# Altium project Seti-Controler-3C.PrjPcb
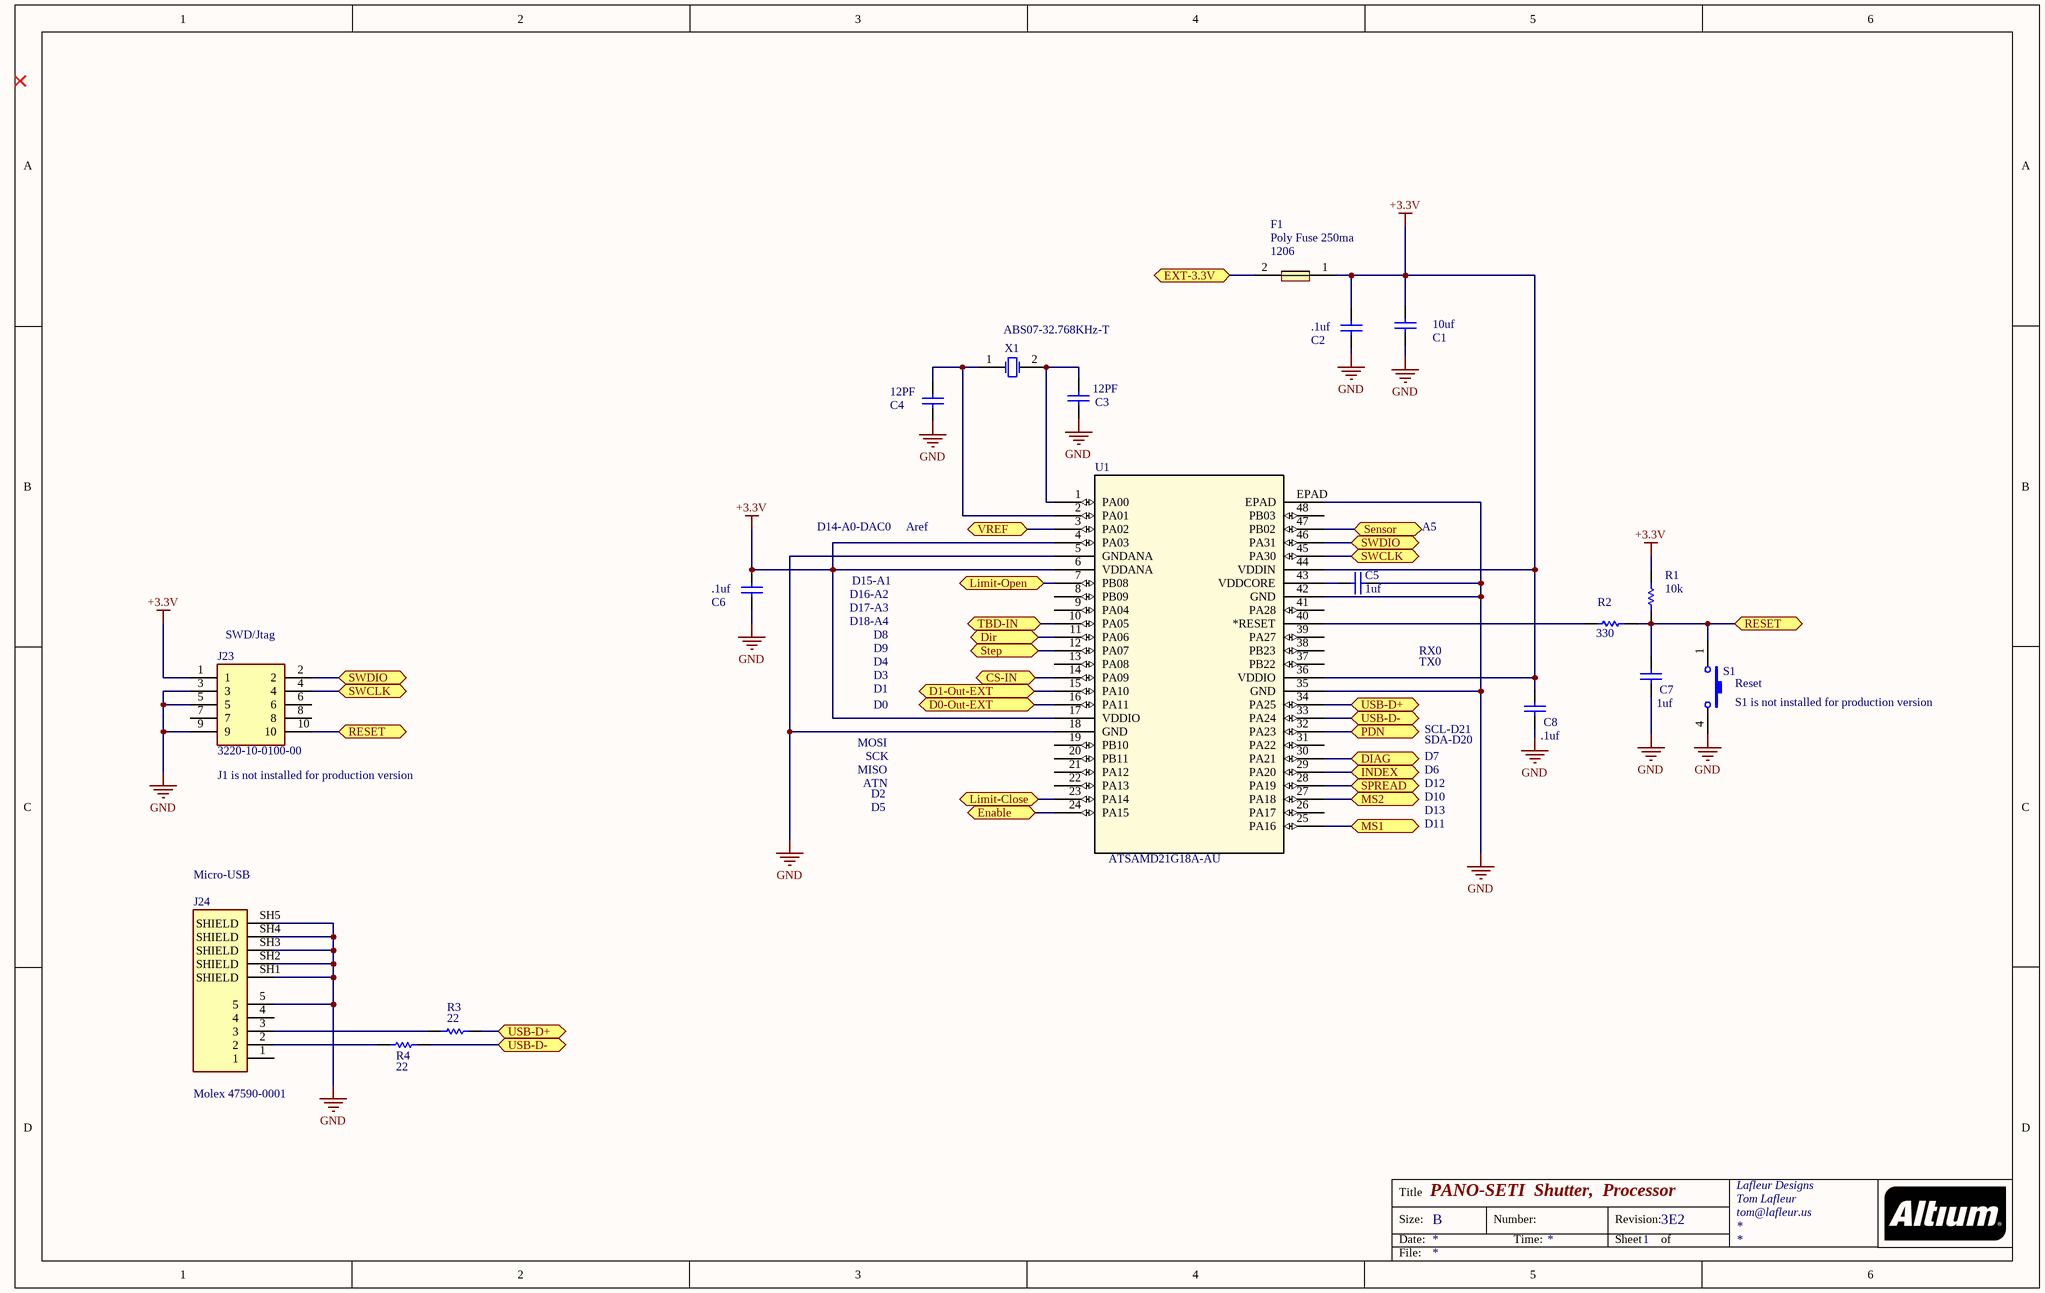
[diagram p0: Sheet1.SchDoc]
2 sheets, 55 parts. Net scope: flat (ports and power ports of the same name join across sheets).
Board file: PCB1.PcbDoc
Sheets:
  Sheet1.SchDoc
  Sheet2.SchDoc

## Sheet Sheet1.SchDoc: PANO-SETI  Shutter,  Processor
size B; Organization: Lafleur Designs; Address1: Tom Lafleur; Address2: tom@lafleur.us; Revision: 3E2; SheetNumber: 1

### Parts
C1  10uf  [6-0805]
C2  .1uf  [6-0805]
C3  12PF  [6-0805]
C4  12PF  [6-0805]
C5  1uf  [6-0805]
C6  .1uf  [6-0805]
C7  1uf  [6-0805]
C8  .1uf  [6-0805]
F1  Poly Fuse 250ma  [8-1206]
J23  3220-10-0100-00  [SHDR10W41P127_2X5_1265X510X565P]
J24  Molex 47590-0001  [Molex 47590-0001]
R1  10k  [6-0805]
R2  330  [6-0805]
R3  22  [6-0805]
R4  22  [6-0805]
S1  Reset  [KMR_2]
U1  ATSAMD21G18A-AU  [TQFP48_7x7MC]
X1  ABS07-32.768KHz-T  [ABRA-ABS07-2_V]

### Ports
CS-IN (bidir), D0-Out-EXT (bidir), D1-Out-EXT (bidir), DIAG (bidir), Dir (bidir), Enable (bidir), EXT-3.3V (bidir), INDEX (bidir), Limit-Close (bidir), Limit-Open (bidir), MS1 (bidir), MS2 (bidir), PDN (bidir), RESET (bidir), Sensor (bidir), SPREAD (bidir), Step (bidir), SWCLK (bidir), SWDIO (bidir), TBD-IN (bidir), USB-D+ (bidir), USB-D- (bidir), VREF (bidir)

### Nets
+3.3V: C1.1 C2.1 C6.1 C8.1 F1.1 J23.1 R1.1 U1.4(PA03) U1.6(VDDANA) U1.17(VDDIO) U1.36(VDDIO) U1.44(VDDIN)
GND: C1.2 C2.2 C3.2 C4.2 C5.2 C6.2 C7.2 C8.2 J23.3 J23.5 J23.9 J24.5 J24.SH1(SHIELD) J24.SH2(SHIELD) J24.SH3(SHIELD) J24.SH4(SHIELD) J24.SH5(SHIELD) S1.4 U1.5(GNDANA) U1.18(GND) U1.35(GND) U1.42(GND) U1.EPAD
NetC3_1: C3.1 U1.1(PA00) X1.2(X2)
NetC4_1: C4.1 U1.2(PA01) X1.1(X1)
NetC5_1: C5.1 U1.43(VDDCORE)
NetC7_1: C7.1 J23.10 R1.2 R2.2 S1.1 ; port RESET
NetC22_2: U1.47(PB02) ; port Sensor
NetF1_2: F1.2 ; port EXT-3.3V
NetJ23_2: J23.2 U1.46(PA31) ; port SWDIO
NetJ23_4: J23.4 U1.45(PA30) ; port SWCLK
NetJ24_2: J24.2 R4.1
NetJ24_3: J24.3 R3.1
NetJP1_2: U1.3(PA02) ; port VREF
NetR2_1: R2.1 U1.40(*RESET)
NetR3_2: R3.2 U1.34(PA25) ; port USB-D+
NetR4_2: R4.2 U1.33(PA24) ; port USB-D-
NetR5_2: U1.24(PA15) ; port Enable
NetR7_1: U1.32(PA23) ; port PDN
NetU1_7: U1.7(PB08) ; port Limit-Open
NetU1_10: U1.10(PA05) ; port TBD-IN
NetU1_11: U1.11(PA06) ; port Dir
NetU1_12: U1.12(PA07) ; port Step
NetU1_14: U1.14(PA09) ; port CS-IN
NetU1_15: U1.15(PA10) ; port D1-Out-EXT
NetU1_16: U1.16(PA11) ; port D0-Out-EXT
NetU1_23: U1.23(PA14) ; port Limit-Close
NetU1_25: U1.25(PA16) ; port MS1
NetU1_27: U1.27(PA18) ; port MS2
NetU1_28: U1.28(PA19) ; port SPREAD
NetU1_29: U1.29(PA20) ; port INDEX
NetU1_30: U1.30(PA21) ; port DIAG

Not connected (* = marked no-connect by the designer): J23 6 7 8; J24 1 4; U1 8(PB09) 9(PA04) 13(PA08) 19(PB10) 20(PB11) 21(PA12) 22(PA13) 26(PA17) 31(PA22) 37(PB22) 38(PB23) 39(PA27) 41(PA28) 48(PB03)

### Notes on the sheet
- (near F1) 1206
- D14-A0-DAC0
- Aref
- A5
- (near J23) SWD/Jtag
- D16-A2
- D17-A3
- D18-A4
- D15-A1
- D8
- D9
- D0
- D1
- D3
- D4
- RX0
- TX0
- (near S1) S1 is not installed for production version
- MOSI
- MISO
- SCK
- D6
- D7
- SCL-D21
- SDA-D20
- (near J23) J1 is not installed for production version
- ATN
- D5
- D2
- D11
- D13
- D10
- D12
- (near J24) Micro-USB
- Title
- Size:
- Date:
- B
- Number:
- Time:
- Revision:
- Sheet
- of
- File:

### Library data of the parts
C1-C8 = CAP_2: Capacitor; Fitted: True
F1 = Poly Fuse
J23 = 3220-10-0100-00: Connector; Manufacturer_Name: CNC Tech; Datasheet Link: http://www.cnctech.us/pdfs/3220-XX-0100-00.pdf; Height: 5.65mm; Manufacturer_Part_Number: 3220-10-0100-00
J24 = 47590-0001: USB - micro AB Receptacle Connector 5 Position Surface Mount, Right Angle; Through Hole; SnapEDA_Link: https://www.snapeda.com/parts/47590-0001/Molex/view-part/47491/?ref=snap; Value: *; MF: Molex; Price: None; Availability: Unavailable; MP: 47590-0001; Package: None
R1-R4 = ERJ8EN: Precision Thick Film Chip Resistor, 10 Ohm to 2.2M Ohm Range, 1% Tolerance, 1206 Size, 0.125 W; Published: 17-Dec-2003; LatestRevisionDate: 19-Mar-2004; LatestRevisionNote: Silkscreen size reduced.; PackageDocument: Mar-2003; PackageReference: 8-1206; Publisher: Altium Limited; Code_IPC: 3216 [1206]; ComponentLink1Description: Manufacturer Link; ComponentLink1URL: http://www.panasonic.com/industrial/components/resistive_products.htm; ComponentLink2Description: Datasheet; ComponentLink2URL: http://www.panasonic.com/industrial/components/pdf/AOA0000CE2.pdf
S1 = SW-PB: Switch; Published: 24-Mar-1999; LatestRevisionDate: 17-Jul-2002; LatestRevisionNote: Re-released for DXP Platform.; PackageReference: SPST-2; Publisher: Altium Limited
U1 = ATSAMD21G18A-AU: No Description Available; Vendor: Microchip; Built_By: EMA_Molly; Manufacturer_Part_Number: ATSAMD21G18A-AU; Copyright: Copyright (C) 2018 Accelerated Designs. All rights reserved; RefDes: RefDes; Type: DEV; Value: Value
X1 = CMP-0447-00001-2: Crystal, 32.768 kHz, 12.5 pF, -40 to 85 degC, SMD Low Profile 3.2 x 1.5 x 0.9 mm, Tape and Reel; Manufacturer: Abracon; Q Value (Type): 30000; Operation Mode: Flexural Mode (Tuning Fork); Shunt Capacitance (C0): 0.9 to 1.2 pF; Load Capacitance (CL): 12.5 pF; Frequency Tolerance @+25degC: +/- 20 ppm; Drive Level (Type): 0.1 uW; Equivalent Series Resistance (R1): 70 Kohm; Insulation Resistance (Min): 500 Mohm; ComponentLink3URL: http://www.abracon.com/Resonators/ABS07.pdf; PackageDescription: 2-Pin Hand Drawn, Body 3.2x1.5mm, Pitch 2.5mm; Operating Temperature: -40 to 85 degC; ComponentLink2URL: http://www.abracon.com/Resonators/ABS07.pdf; PackageReference: ABS07-2; ComponentLink3Description: Package Specification; ComponentLink1Description: Manufacturer URL; DatasheetVersion: 04.03.13; Mounting Technology: Surface Mount; ComponentLink2Description: Datasheet; ComponentLink1URL: http://www.abracon.com/; PartNumber: ABS07-32.768KHz-T; Packing: Tape and Reel; Frequency: 32.768 kHz

## Sheet Sheet2.SchDoc: PANO-SETI  Shutter, Stepper Driver
size B; Organization: Lafleur Designs; Address1: Tom Lafleur; Address2: tom@lafleur.us; Revision: 3E2; SheetNumber: 2
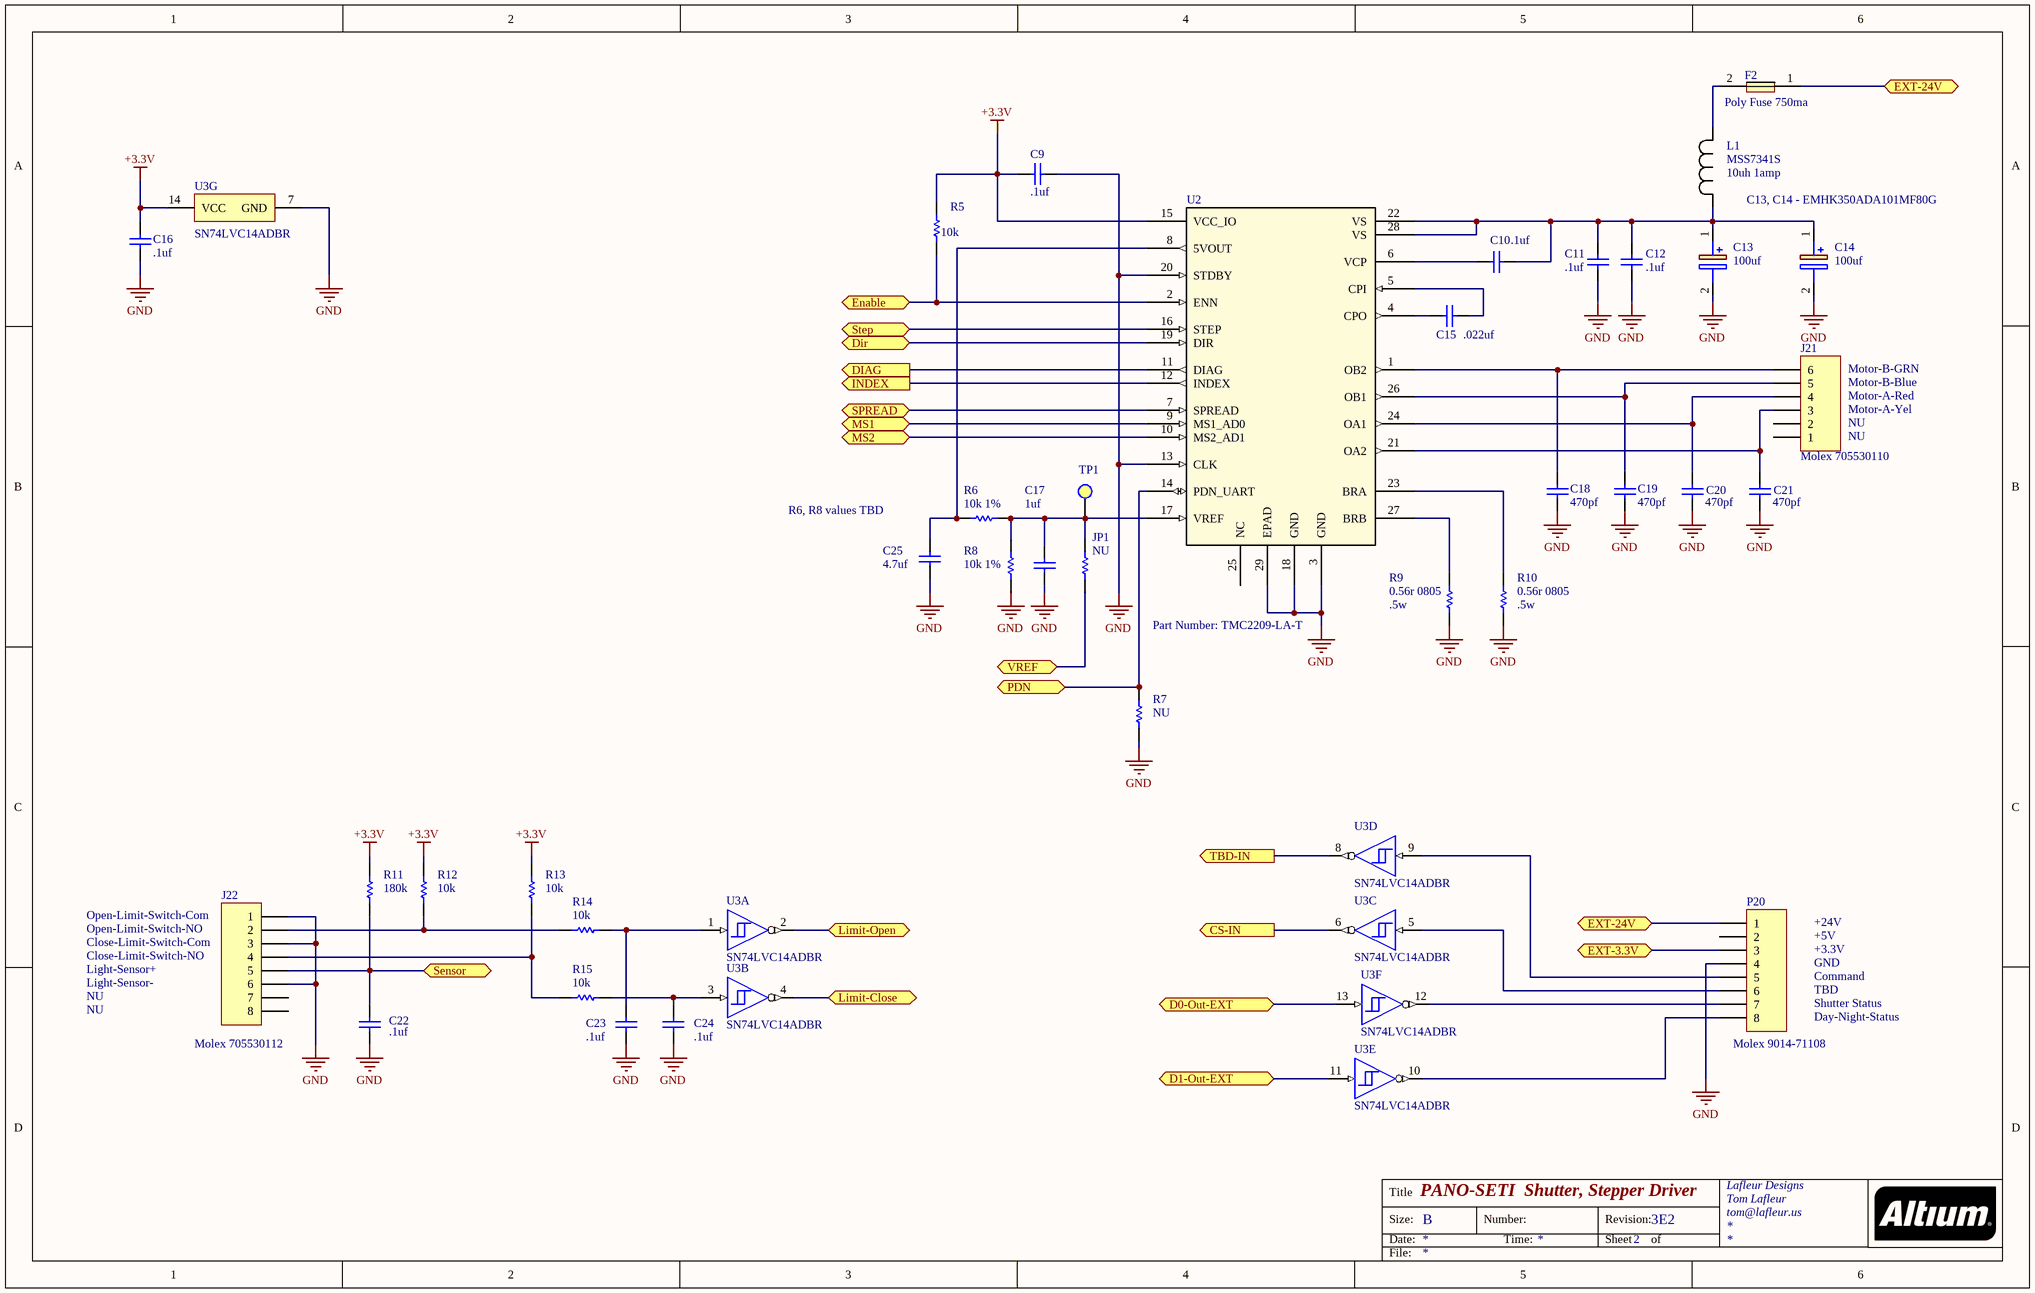
[diagram p1: Sheet2.SchDoc]

### Parts
C9  .1uf  [6-0805]
C10  .1uf  [6-0805]
C11  .1uf  [6-0805]
C12  .1uf  [6-0805]
C13  100uf  [SMD_Lytic_F]
C14  100uf  [SMD_Lytic_F]
C15  .022uf  [6-0805]
C16  .1uf  [6-0805]
C17  1uf  [6-0805]
C18  470pf  [6-0805]
C19  470pf  [6-0805]
C20  470pf  [6-0805]
C21  470pf  [6-0805]
C22  .1uf  [6-0805]
C23  .1uf  [6-0805]
C24  .1uf  [6-0805]
C25  4.7uf  [6-0805]
F2  Poly Fuse 750ma  [PTC 2016L]
J21  Molex 705530110  [HDR1X6]
J22  Molex 705530112  [HDR1X8]
JP1  NU  [6-0805]
L1  MSS7341S  [MSS7341502NLD]
P20  Molex 9014-71108  [HDR1X8]
R5  10k  [6-0805]
R6  10k 1%  [6-0805]
R7  NU  [6-0805]
R8  10k 1%  [6-0805]
R9  0.56r 0805  [6-0805]
R10  0.56r 0805  [6-0805]
R11  180k  [6-0805]
R12  10k  [6-0805]
R13  10k  [6-0805]
R14  10k  [6-0805]
R15  10k  [6-0805]
TP1  TestPoint  [Test Point-Thru-Hole]  (value not drawn)
U2  Part Number: TMC2209-LA-T  [QFN50P500X500X90-29N]
U3  SN74LVC14ADBR  [DB0014A_M]  (parts A,B,C,D,E,F,G of 7)

### Ports
CS-IN (out), D0-Out-EXT (bidir), D1-Out-EXT (bidir), DIAG (out), Dir (bidir), Enable (bidir), EXT-3.3V (bidir), EXT-24V (bidir), INDEX (out), Limit-Close (bidir), Limit-Open (bidir), MS1 (bidir), MS2 (bidir), PDN (bidir), Sensor (bidir), SPREAD (bidir), Step (bidir), TBD-IN (out), VREF (bidir)

### Nets
+3.3V: C9.1 C16.2 R5.1 R11.1 R12.1 R13.1 U2.15(VCC_IO) U3.14(VCC)
GND: C9.2 C11.2 C12.2 C13.2(-) C14.2(-) C16.1 C17.2 C18.2 C19.2 C20.2 C21.2 C22.1 C23.1 C24.1 C25.2 J22.1 J22.3 J22.6 P20.4 R7.2 R8.2 R9.2 R10.2 U2.3(GND) U2.13(CLK) U2.18(GND) U2.20(STDBY) U2.29(EPAD) U3.7(GND)
NetC10_1: C10.1 U2.6(VCP)
NetC10_2: C10.2 C11.1 C12.1 C13.1(+) C14.1(+) L1.2 U2.22(VS) U2.28(VS)
NetC15_1: C15.1 U2.4(CPO)
NetC15_2: C15.2 U2.5(CPI)
NetC17_1: C17.1 JP1.1 R6.2 R8.1 TP1.1(TP?) U2.17(VREF)
NetC18_1: C18.1 J21.6 U2.1(OB2)
NetC19_1: C19.1 J21.5 U2.26(OB1)
NetC20_1: C20.1 J21.4 U2.24(OA1)
NetC21_1: C21.1 J21.3 U2.21(OA2)
NetC22_2: C22.2 J22.5 R11.2 ; port Sensor
NetC23_2: C23.2 R14.2 U3.1(1A)
NetC24_2: C24.2 R15.2 U3.3(2A)
NetC25_1: C25.1 R6.1 U2.8(5VOUT)
NetF1_2: P20.3 ; port EXT-3.3V
NetF2_1: F2.1 P20.1 ; port EXT-24V
NetF2_2: F2.2 L1.1
NetJ22_2: J22.2 R12.2 R14.1
NetJ22_4: J22.4 R13.2 R15.1
NetJP1_2: JP1.2 ; port VREF
NetP20_5: P20.5 U3.9(4A)
NetP20_6: P20.6 U3.5(3A)
NetP20_7: P20.7 U3.12(~{6Y})
NetP20_8: P20.8 U3.10(~{5Y})
NetR5_2: R5.2 U2.2(ENN) ; port Enable
NetR7_1: R7.1 U2.14(PDN_UART) ; port PDN
NetR9_1: R9.1 U2.27(BRB)
NetR10_1: R10.1 U2.23(BRA)
NetU1_7: U3.2(~{1Y}) ; port Limit-Open
NetU1_10: U3.8(~{4Y}) ; port TBD-IN
NetU1_11: U2.19(DIR) ; port Dir
NetU1_12: U2.16(STEP) ; port Step
NetU1_14: U3.6(~{3Y}) ; port CS-IN
NetU1_15: U3.11(5A) ; port D1-Out-EXT
NetU1_16: U3.13(6A) ; port D0-Out-EXT
NetU1_23: U3.4(~{2Y}) ; port Limit-Close
NetU1_25: U2.9(MS1_AD0) ; port MS1
NetU1_27: U2.10(MS2_AD1) ; port MS2
NetU1_28: U2.7(SPREAD) ; port SPREAD
NetU1_29: U2.12(INDEX) ; port INDEX
NetU1_30: U2.11(DIAG) ; port DIAG

Not connected (* = marked no-connect by the designer): J21 1 2; J22 7 8; P20 2; U2 25(NC)

### Notes on the sheet
- (near L1) 10uh 1amp
- C13, C14 - EMHK350ADA101MF80G
- (near J21) Motor-B-GRN
- (near J21) NU
- (near J21) Motor-A-Red
- (near J21) Motor-A-Yel
- (near J21) Motor-B-Blue
- R6, R8 values TBD
- .5w
- (near R10) .5w
- Light-Sensor+
- (near J22) Open-Limit-Switch-Com
- Open-Limit-Switch-NO
- (near J22) Close-Limit-Switch-Com
- (near J22) Close-Limit-Switch-NO
- +24V
- +5V
- +3.3V
- GND
- NU
- Light-Sensor-
- Shutter Status
- TBD
- Day-Night-Status
- Command
- Title
- Size:
- Date:
- B
- Number:
- Time:
- Revision:
- Sheet
- of
- File:

### Library data of the parts
C9-C12 C15-C25 = CAP_2: Capacitor; Fitted: True
C13 C14 = EEE-HA1V101UP: Capacitor Polarised; Manufacturer_Name: Panasonic; Datasheet Link: http://industrial.panasonic.com/cdbs/www-data/pdf/RDE0000/ABA0000C1151.pdf; Height: 10mm; Manufacturer_Part_Number: EEE-HA1V101UP; Mouser Part Number: 667-EEE-HA1V101UP; Mouser Price/Stock: https://www.mouser.co.uk/ProductDetail/Panasonic/EEE-HA1V101UP?qs=ECX%252BeLvXSgSV%2Fbj%252B%2FHs12Q%3D%3D; Arrow Part Number: EEE-HA1V101UP; Arrow Price/Stock: https://www.arrow.com/en/products/eee-ha1v101up/panasonic
F2 = Poly Fuse
J21 = Header 6: Header, 6-Pin; LatestRevisionDate: 17-Jul-2002; LatestRevisionNote: Re-released for DXP Platform.; Publisher: Altium Limited
J22 P20 = Header 8: Header, 8-Pin; LatestRevisionDate: 17-Jul-2002; LatestRevisionNote: Re-released for DXP Platform.; Publisher: Altium Limited
JP1 R5-R15 = ERJ8EN: as R1 on sheet Sheet1; Published: 17-Dec-2003; LatestRevisionDate: 19-Mar-2004; LatestRevisionNote: Silkscreen size reduced.; PackageDocument: Mar-2003; PackageReference: 8-1206; Publisher: Altium Limited; Code_IPC: 3216 [1206]; ComponentLink1Description: Manufacturer Link; ComponentLink1URL: http://www.panasonic.com/industrial/components/resistive_products.htm; ComponentLink2Description: Datasheet; ComponentLink2URL: http://www.panasonic.com/industrial/components/pdf/AOA0000CE2.pdf
L1 = SRU1048-101Y: No Description Available; Vendor: Bourns Electronics; Built_By: EMA_UL_Team; Manufacturer_Part_Number: SRU1048-101Y; Copyright: Copyright (C) 2018 Accelerated Designs. All rights reserved; Value: Value
U2 = TMC2209-LA-T: No Description Available; Vendor: Trinamic; Manufacturer_Part_Number: TMC2209-LA-T; Copyright: Copyright (C) 2018 Accelerated Designs. All rights reserved; RefDes: RefDes; Type: DEV; Value: Value
U3 = CMP-1615-00327-3: Hex Schmitt-Trigger Inverter, DB0014A, LARGE T&R; Manufacturer: Texas Instruments; tpd @ Nom Voltage(Max)(ns): 11,7.8,7.5,6.4; Output Type: CMOS; Voltage(Nom)(V): 1.8,2.5,2.7,3.3; F @ Nom Voltage(Max)(Mhz): 100; ICC @ Nom Voltage(Max)(mA): 0.01; Input Type: CMOS,TTL; VCC(Max)(V): 3.6; Schmitt Trigger: Yes; Technology Family: LVC; VCC(Min)(V): 2; Output Drive (IOL/IOH)(Max)(mA): -24/24; Bits(#): 6; Rating: Catalog; Code_JEDEC: MO-150; PackageReference: DB0014A; Generic Part Number: SN74LVC14A; Operating Temperature Range(C): -40 to 125; DatasheetVersion: SCAS285AA

## Nets that join several sheets
+3.3V: Sheet1 (12 pins), Sheet2 (8 pins)
GND: Sheet1 (23 pins), Sheet2 (29 pins)
NetC22_2: Sheet1 (U1.47), Sheet2 (C22.2 J22.5 R11.2)
NetF1_2: Sheet1 (F1.2), Sheet2 (P20.3)
NetJP1_2: Sheet1 (U1.3), Sheet2 (JP1.2)
NetR5_2: Sheet1 (U1.24), Sheet2 (R5.2 U2.2)
NetR7_1: Sheet1 (U1.32), Sheet2 (R7.1 U2.14)
NetU1_7: Sheet1 (U1.7), Sheet2 (U3.2)
NetU1_10: Sheet1 (U1.10), Sheet2 (U3.8)
NetU1_11: Sheet1 (U1.11), Sheet2 (U2.19)
NetU1_12: Sheet1 (U1.12), Sheet2 (U2.16)
NetU1_14: Sheet1 (U1.14), Sheet2 (U3.6)
NetU1_15: Sheet1 (U1.15), Sheet2 (U3.11)
NetU1_16: Sheet1 (U1.16), Sheet2 (U3.13)
NetU1_23: Sheet1 (U1.23), Sheet2 (U3.4)
NetU1_25: Sheet1 (U1.25), Sheet2 (U2.9)
NetU1_27: Sheet1 (U1.27), Sheet2 (U2.10)
NetU1_28: Sheet1 (U1.28), Sheet2 (U2.7)
NetU1_29: Sheet1 (U1.29), Sheet2 (U2.12)
NetU1_30: Sheet1 (U1.30), Sheet2 (U2.11)